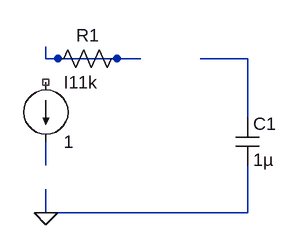
[diagram p0: schematic 05-rc-circuit.asc]
05-rc-circuit.asc, the LTspice schematic file:
Version 4
SHEET 1 880 680
WIRE 144 96 144 80
WIRE 272 96 144 96
WIRE 416 96 352 96
WIRE 416 176 416 96
WIRE 144 240 144 208
WIRE 416 304 416 240
WIRE 144 304 144 272
WIRE 416 304 144 304
FLAG 144 304 0
SYMBOL current 144 128 R0
WINDOW 123 0 0 Left 0
WINDOW 39 0 0 Left 0
SYMATTR InstName I1
SYMATTR Value 1
SYMBOL res 256 80 R90
WINDOW 0 0 56 VBottom 2
WINDOW 3 32 56 VTop 2
SYMATTR InstName R1
SYMATTR Value 1k
SYMBOL cap 400 176 R0
SYMATTR InstName C1
SYMATTR Value 1µ

The netlist it stands for:
* 05-rc-circuit.asc
I1 NC_01 N003 1
R1 N001 N001 1k
C1 N002 0 1µ
.backanno
.end